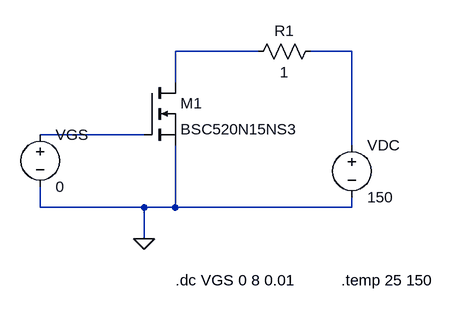
[diagram p0: schematic transfer characteristics.asc]
transfer characteristics.asc, the LTspice schematic file:
Version 4
SHEET 1 880 680
WIRE 304 48 176 48
WIRE 448 48 384 48
WIRE 176 96 176 48
WIRE 128 176 -32 176
WIRE 448 192 448 48
WIRE -32 288 -32 256
WIRE 128 288 -32 288
WIRE 176 288 176 192
WIRE 176 288 128 288
WIRE 448 288 448 272
WIRE 448 288 176 288
WIRE 128 336 128 288
FLAG 128 336 0
SYMBOL nmos 128 96 R0
SYMATTR InstName M1
SYMATTR Value BSC520N15NS3
SYMBOL voltage -32 160 R0
WINDOW 123 0 0 Left 2
WINDOW 39 0 0 Left 2
SYMATTR InstName VGS
SYMATTR Value 0
SYMBOL voltage 448 176 R0
WINDOW 123 0 0 Left 2
WINDOW 39 0 0 Left 2
SYMATTR InstName VDC
SYMATTR Value 150
SYMBOL res 400 32 R90
WINDOW 0 0 56 VBottom 2
WINDOW 3 32 56 VTop 2
SYMATTR InstName R1
SYMATTR Value 1
TEXT 176 400 Left 2 !.dc VGS 0 8 0.01
TEXT 432 400 Left 2 !.temp 25 150

The netlist it stands for:
* transfer characteristics.asc
M1 N001 N003 0 0 BSC520N15NS3
VGS N003 0 0
VDC N002 0 150
R1 N002 N001 1
.model NMOS NMOS
.model PMOS PMOS
.lib standard.mos
.dc VGS 0 8 0.01
.temp 25 150
.backanno
.end

* Results of the author's LTspice run, read from the files saved beside the schematic
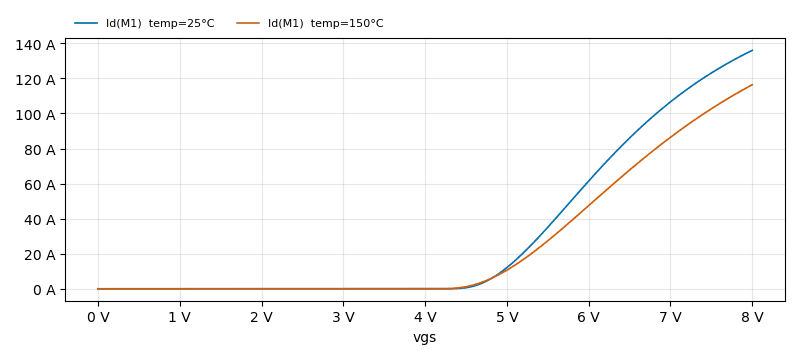
[diagram p1: DC transfer characteristic of transfer characteristics.asc, plotted from the saved traces]
* DC transfer characteristic, 2 runs:
*   Id(M1) [temp=25°C]: 174.5 pA at vgs=0 V, 136 A at vgs=8 V, min 174.5 pA, max 136 A
*   Id(M1) [temp=150°C]: 2.243 µA at vgs=0 V, 116.4 A at vgs=8 V, min 2.243 µA, max 116.4 A